# Altium schematic sheet DC_POWER.SchDoc
size A4
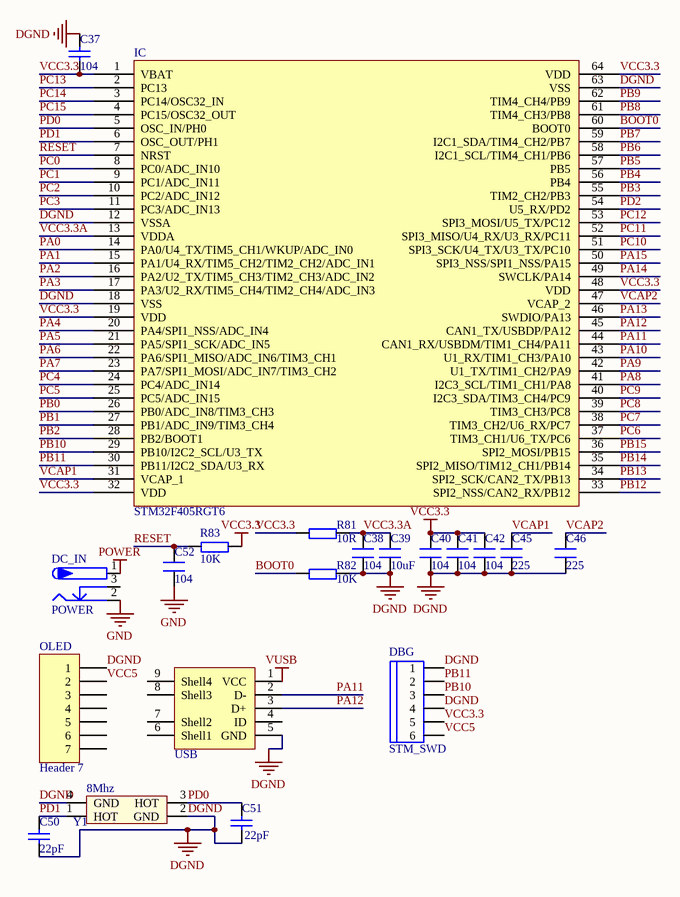
[diagram p0: DC_POWER.SchDoc]

## Parts
C37  104  [C 0603_L]
C38  104  [C 0603_L]
C39  10uF  [C 0603_L]
C40  104  [C 0603_L]
C41  104  [C 0603_L]
C42  104  [C 0603_L]
C45  225  [C 0603_L]
C46  225  [C 0603_L]
C50  22pF  [C 0603_L]
C51  22pF  [C 0603_L]
C52  104  [C 0603_L]
DBG  STM_SWD  [SH1.0_6P]
DC_IN  POWER  [DC10B]
IC  STM32F405RGT6  [LQFP64 10X10_L]
OLED  Header 7  [HDR2.54-M-LI-7P]
R81  10R  [R 0603_L]
R82  10K  [R 0603_L]
R83  10K  [R 0603_L]
USB  MICRO-USB  [USB-AB-5S]  (value not drawn)
Y1  8Mhz  [XTAL-3225]

## Nets
DGND: C37.1 C38.1 C39.1 C40.1 C41.1 C42.1 C45.1 C46.1 C50.1 C51.1 DBG.1 DBG.4 IC.12(VSSA) IC.18(VSS) IC.63(VSS) OLED.1 R82.2 USB.5(GND) Y1.2(GND) Y1.4(GND)
GND: C52.1 DC_IN.2
POWER: DC_IN.1
VCC3.3: C37.2 C40.2 C41.2 C42.2 DBG.5 IC.1(VBAT) IC.19(VDD) IC.32(VDD) IC.48(VDD) IC.64(VDD) R81.1 R83.2
VUSB: USB.1(VCC)
BOOT0: IC.60(BOOT0) R82.1
PA0: IC.14(PA0/U4_TX/TIM5_CH1/WKUP/ADC_IN0)
PA1: IC.15(PA1/U4_RX/TIM5_CH2/TIM2_CH2/ADC_IN1)
PA2: IC.16(PA2/U2_TX/TIM5_CH3/TIM2_CH3/ADC_IN2)
PA3: IC.17(PA3/U2_RX/TIM5_CH4/TIM2_CH4/ADC_IN3)
PA4: IC.20(PA4/SPI1_NSS/ADC_IN4)
PA5: IC.21(PA5/SPI1_SCK/ADC_IN5)
PA6: IC.22(PA6/SPI1_MISO/ADC_IN6/TIM3_CH1)
PA7: IC.23(PA7/SPI1_MOSI/ADC_IN7/TIM3_CH2)
PA8: IC.41(I2C3_SCL/TIM1_CH1/PA8)
PA9: IC.42(U1_TX/TIM1_CH2/PA9)
PA10: IC.43(U1_RX/TIM1_CH3/PA10)
PA11: IC.44(CAN1_RX/USBDM/TIM1_CH4/PA11) USB.2(D-)
PA12: IC.45(CAN1_TX/USBDP/PA12) USB.3(D+)
PA13: IC.46(SWDIO/PA13)
PA14: IC.49(SWCLK/PA14)
PA15: IC.50(SPI3_NSS/SPI1_NSS/PA15)
PB0: IC.26(PB0/ADC_IN8/TIM3_CH3)
PB1: IC.27(PB1/ADC_IN9/TIM3_CH4)
PB2: IC.28(PB2/BOOT1)
PB3: IC.55(TIM2_CH2/PB3)
PB4: IC.56(PB4)
PB5: IC.57(PB5)
PB6: IC.58(I2C1_SCL/TIM4_CH1/PB6)
PB7: IC.59(I2C1_SDA/TIM4_CH2/PB7)
PB8: IC.61(TIM4_CH3/PB8)
PB9: IC.62(TIM4_CH4/PB9)
PB10: DBG.3 IC.29(PB10/I2C2_SCL/U3_TX)
PB11: DBG.2 IC.30(PB11/I2C2_SDA/U3_RX)
PB12: IC.33(SPI2_NSS/CAN2_RX/PB12)
PB13: IC.34(SPI2_SCK/CAN2_TX/PB13)
PB14: IC.35(SPI2_MISO/TIM12_CH1/PB14)
PB15: IC.36(SPI2_MOSI/PB15)
PC0: IC.8(PC0/ADC_IN10)
PC1: IC.9(PC1/ADC_IN11)
PC2: IC.10(PC2/ADC_IN12)
PC3: IC.11(PC3/ADC_IN13)
PC4: IC.24(PC4/ADC_IN14)
PC5: IC.25(PC5/ADC_IN15)
PC6: IC.37(TIM3_CH1/U6_TX/PC6)
PC7: IC.38(TIM3_CH2/U6_RX/PC7)
PC8: IC.39(TIM3_CH3/PC8)
PC9: IC.40(I2C3_SDA/TIM3_CH4/PC9)
PC10: IC.51(SPI3_SCK/U4_TX/U3_TX/PC10)
PC11: IC.52(SPI3_MISO/U4_RX/U3_RX/PC11)
PC12: IC.53(SPI3_MOSI/U5_TX/PC12)
PC13: IC.2(PC13)
PC14: IC.3(PC14/OSC32_IN)
PC15: IC.4(PC15/OSC32_OUT)
PD0: C51.2 IC.5(OSC_IN/PH0) Y1.3(HOT)
PD1: C50.2 IC.6(OSC_OUT/PH1) Y1.1(HOT)
PD2: IC.54(U5_RX/PD2)
RESET: C52.2 IC.7(NRST) R83.1
VCAP1: C45.2 IC.31(VCAP_1)
VCAP2: C46.2 IC.47(VCAP_2)
VCC3.3A: C38.2 C39.2 IC.13(VDDA) R81.2
VCC5: DBG.6 OLED.2

Not connected (* = marked no-connect by the designer): DC_IN 3; OLED 3 4 5 6 7; USB 4(ID) 6(Shell1) 7(Shell2) 8(Shell3) 9(Shell4)

## Library data of the parts
C37 C50 C51 = CAP
C38-C42 C45 C46 C52 = C
DBG = HEAD6
DC_IN = P-DC: 低压电源接口; BOM名称: DC电源接口; 版权归属: 源创客; 学习资源: www.ooocke.com
IC = STM32F405RGT6: Flaah:256/RAM:48/IO:51
OLED = Header 7: Header, 7-Pin; LatestRevisionDate: 17-Jul-2002; LatestRevisionNote: Re-released for DXP Platform.; Publisher: Altium Limited
R81-R83 = R
USB = J-MICRO-USB-5S: Micro USB 5.9有柱脚长1.25加长针
Y1 = XTAL_3225: 3225贴片无源晶振